# Altium schematic sheet ProgramIC.SchDoc
size A4
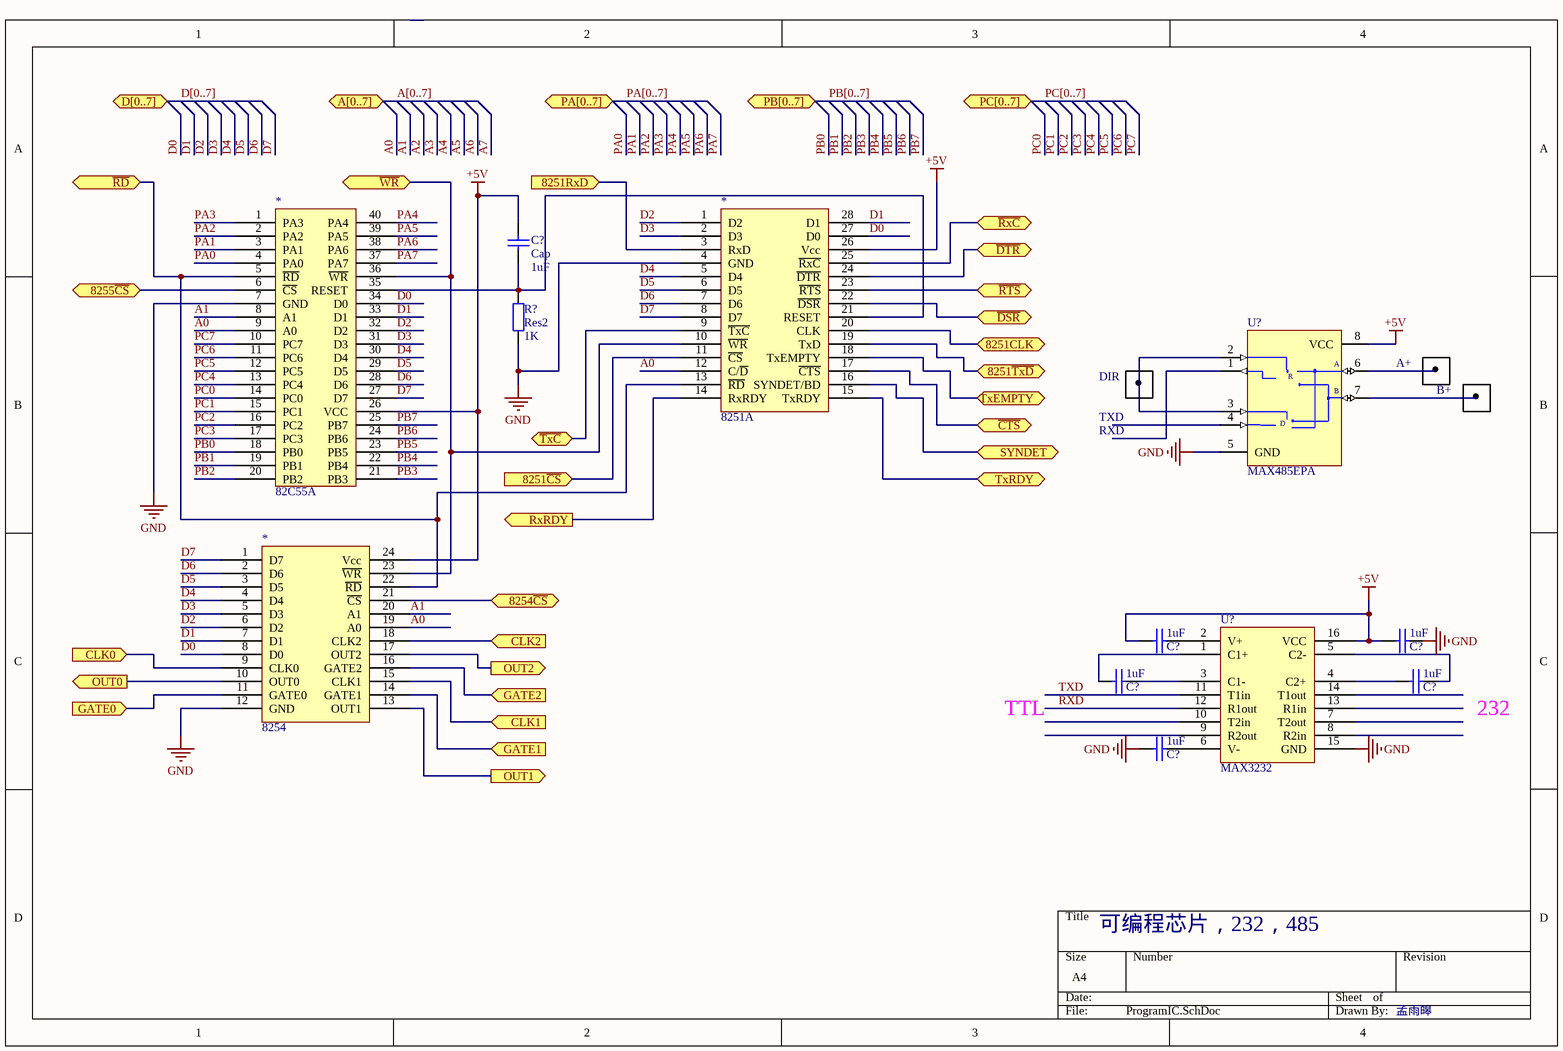
[diagram p0: ProgramIC.SchDoc]

## Parts
(Parts that share a designator on the sheet are numbered #1, #2 ... from top to bottom, then left to right.)
*#1  8251A
*#2  82C55A
*#3  8254
?#1  A+
?#2  DIR
?#3  B+
C?#1  Cap  value 1uF  [RAD-0.3]
C?#2  1uF  [0603C]
C?#3  1uF  [0603C]
C?#4  1uF  [0603C]
C?#5  1uF  [0603C]
C?#6  1uF  [0603C]
R?  Res2  value 1K  [AXIAL-0.4]
U?#1  MAX485EPA  [PA8]
U?#2  MAX3232  [max3232]

## Ports
8251CLK, 8251RxD (in), 8251~{CS} (in), 8251~{TxD}, 8254~{CS}, 8255~{CS}, A[0..7] (bidir), CLK0 (in), CLK1 (in), CLK2 (in), D[0..7] (bidir), GATE0 (in), GATE1 (in), GATE2 (in), OUT0 (out), OUT1 (out), OUT2 (out), PA[0..7] (bidir), PB[0..7] (bidir), PC[0..7] (bidir), RxRDY (out), SYNDET, TxEMPTY (bidir), TxRDY, ~{CTS}, ~{DSR}, ~{DTR} (bidir), ~{RD} (bidir), ~{RTS} (bidir), ~{RxC}, ~{TxC}, ~{WR}

## Nets
+5V: *#1.26(Vcc) *#2.26(VCC) *#3.24(Vcc) C?#1.1 C?#2.1 C?#3.1 U?#1.8(VCC) U?#2.16(VCC)
GND: *#1.4(GND) *#2.7(GND) *#3.12(GND) C?#3.2 C?#6.1 R?.2 U?#1.5(GND) U?#2.15(GND)
8251~{CS}: *#1.11(~{CS}) ; port 8251~{CS}
8251CLK: *#1.20(CLK) ; port 8251CLK
8251RxD: *#1.3(RxD) ; port 8251RxD
8251~{TxD}: *#1.19(TxD) ; port 8251~{TxD}
8254~{CS}: *#3.21(~{CS}) ; port 8254~{CS}
8255~{CS}: *#2.6(~{CS}) ; port 8255~{CS}
A0: *#1.12(C/~{D}) *#2.9(A0) *#3.19(A0)
A1: *#2.8(A1) *#3.20(A1)
~{CTS}: *#1.17(~{CTS}) ; port ~{CTS}
CLK0: *#3.9(CLK0) ; port CLK0
CLK1: *#3.15(CLK1) ; port CLK1
CLK2: *#3.18(CLK2) ; port CLK2
D0: *#1.27(D0) *#2.34(D0) *#3.8(D0)
D1: *#1.28(D1) *#2.33(D1) *#3.7(D1)
D2: *#1.1(D2) *#2.32(D2) *#3.6(D2)
D3: *#1.2(D3) *#2.31(D3) *#3.5(D3)
D4: *#1.5(D4) *#2.30(D4) *#3.4(D4)
D5: *#1.6(D5) *#2.29(D5) *#3.3(D5)
D6: *#1.7(D6) *#2.28(D6) *#3.2(D6)
D7: *#1.8(D7) *#2.27(D7) *#3.1(D7)
~{DSR}: *#1.22(~{DSR}) ; port ~{DSR}
~{DTR}: *#1.24(~{DTR}) ; port ~{DTR}
GATE0: *#3.11(GATE0) ; port GATE0
GATE1: *#3.14(GATE1) ; port GATE1
GATE2: *#3.16(GATE2) ; port GATE2
OUT0: *#3.10(OUT0) ; port OUT0
OUT1: *#3.13(OUT1) ; port OUT1
OUT2: *#3.17(OUT2) ; port OUT2
PA0: *#2.4(PA0)
PA1: *#2.3(PA1)
PA2: *#2.2(PA2)
PA3: *#2.1(PA3)
PA4: *#2.40(PA4)
PA5: *#2.39(PA5)
PA6: *#2.38(PA6)
PA7: *#2.37(PA7)
PB0: *#2.18(PB0)
PB1: *#2.19(PB1)
PB2: *#2.20(PB2)
PB3: *#2.21(PB3)
PB4: *#2.22(PB4)
PB5: *#2.23(PB5)
PB6: *#2.24(PB6)
PB7: *#2.25(PB7)
PC0: *#2.14(PC0)
PC1: *#2.15(PC1)
PC2: *#2.16(PC2)
PC3: *#2.17(PC3)
PC4: *#2.13(PC4)
PC5: *#2.12(PC5)
PC6: *#2.11(PC6)
PC7: *#2.10(PC7)
~{RD}: *#1.13(~{RD}) *#2.5(~{RD}) *#3.22(~{RD}) ; port ~{RD}
~{RTS}: *#1.23(~{RTS}) ; port ~{RTS}
~{RxC}: *#1.25(~{RxC}) ; port ~{RxC}
RXD: U?#2.12(R1out)
RxRDY: *#1.14(RxRDY) ; port RxRDY
SYNDET: *#1.16(SYNDET/BD) ; port SYNDET
~{TxC}: *#1.9(~{TxC}) ; port ~{TxC}
TXD: U?#2.11(T1in)
TxEMPTY: *#1.18(TxEMPTY) ; port TxEMPTY
TxRDY: *#1.15(TxRDY) ; port TxRDY
~{WR}: *#1.10(~{WR}) *#2.36(~{WR}) *#3.23(~{WR}) ; port ~{WR}
Net*#1_21: *#1.21(RESET) *#2.35(RESET) C?#1.2 R?.1
NetC?#2_2: C?#2.2 U?#2.2(V+)
NetC?#4_1: C?#4.1 U?#2.1(C1+)
NetC?#4_2: C?#4.2 U?#2.3(C1-)
NetC?#5_1: C?#5.1 U?#2.4(C2+)
NetC?#5_2: C?#5.2 U?#2.5(C2-)
NetC?#6_2: C?#6.2 U?#2.6(V-)
NetU?#1_2: U?#1.2(~{RE}) U?#1.3(DE)

Not connected (* = marked no-connect by the designer): U?#1 1(RO) 4(DI) 6(A) 7(B); U?#2 7(T2out) 8(R2in) 9(R2out) 10(T2in) 13(R1in) 14(T1out)

## Buses and harness runs
bus A[0..7] = port A[0..7]
bus D[0..7] = port D[0..7]
bus PA[0..7] = port PA[0..7]
bus PB[0..7] = port PB[0..7]
bus PC[0..7] = port PC[0..7]

## Notes on the sheet
- (near ?#2) TXD
- RXD
- TTL
- 232
- 可编程芯片，232，485
- 孟雨皞
- (in symbol MAX485EPA) R; D
- (in symbol 方框) .

## Library data of the parts
?#1-?#3 = 方框
C?#1 = Cap: Capacitor; Published: 8-Jun-2000; LatestRevisionDate: 17-Jul-2002; LatestRevisionNote: Re-released for DXP Platform.; PackageReference: RAD-0.3; Publisher: Altium Limited; PackageDescription: Radial Cap, Thru-Hole; 2 Leads; 0.3 in Pin Spacing
C?#2-C?#6 = CAP: Capacitor
R? = Res2: Resistor; Published: 8-Jun-2000; LatestRevisionDate: 17-Jul-2002; LatestRevisionNote: Re-released for DXP Platform.; PackageReference: AXIAL-0.4; Publisher: Altium Limited; PackageDescription: Axial Device, Thru-Hole; 2 Leads; 0.4 in Pin Spacing
U?#1 = MAX485EPA: Low-Power, Slew-Rate-Limited RS-485/RS-422 Transceiver; Published: 16-Jan-2001; LatestRevisionDate: 29-May-2009; LatestRevisionNote: Component Body Added.; DatasheetVersion: Feb-1996; PackageVersion: RevB, 21-0043; PackageReference: PA8; Publisher: Altium Limited; PackageDescription: DIP, 8-Pin, Row Spacing 7.62 mm, Pitch 2.54 mm; Code_JEDEC: MS-001-AB; ComponentLink1Description: Manufacturer Link; ComponentLink1URL: http://www.maxim-ic.com/; ComponentLink2Description: Datasheet; ComponentLink2URL: http://pdfserv.maxim-ic.com/en/ds/MAX1487-MAX491.pdf